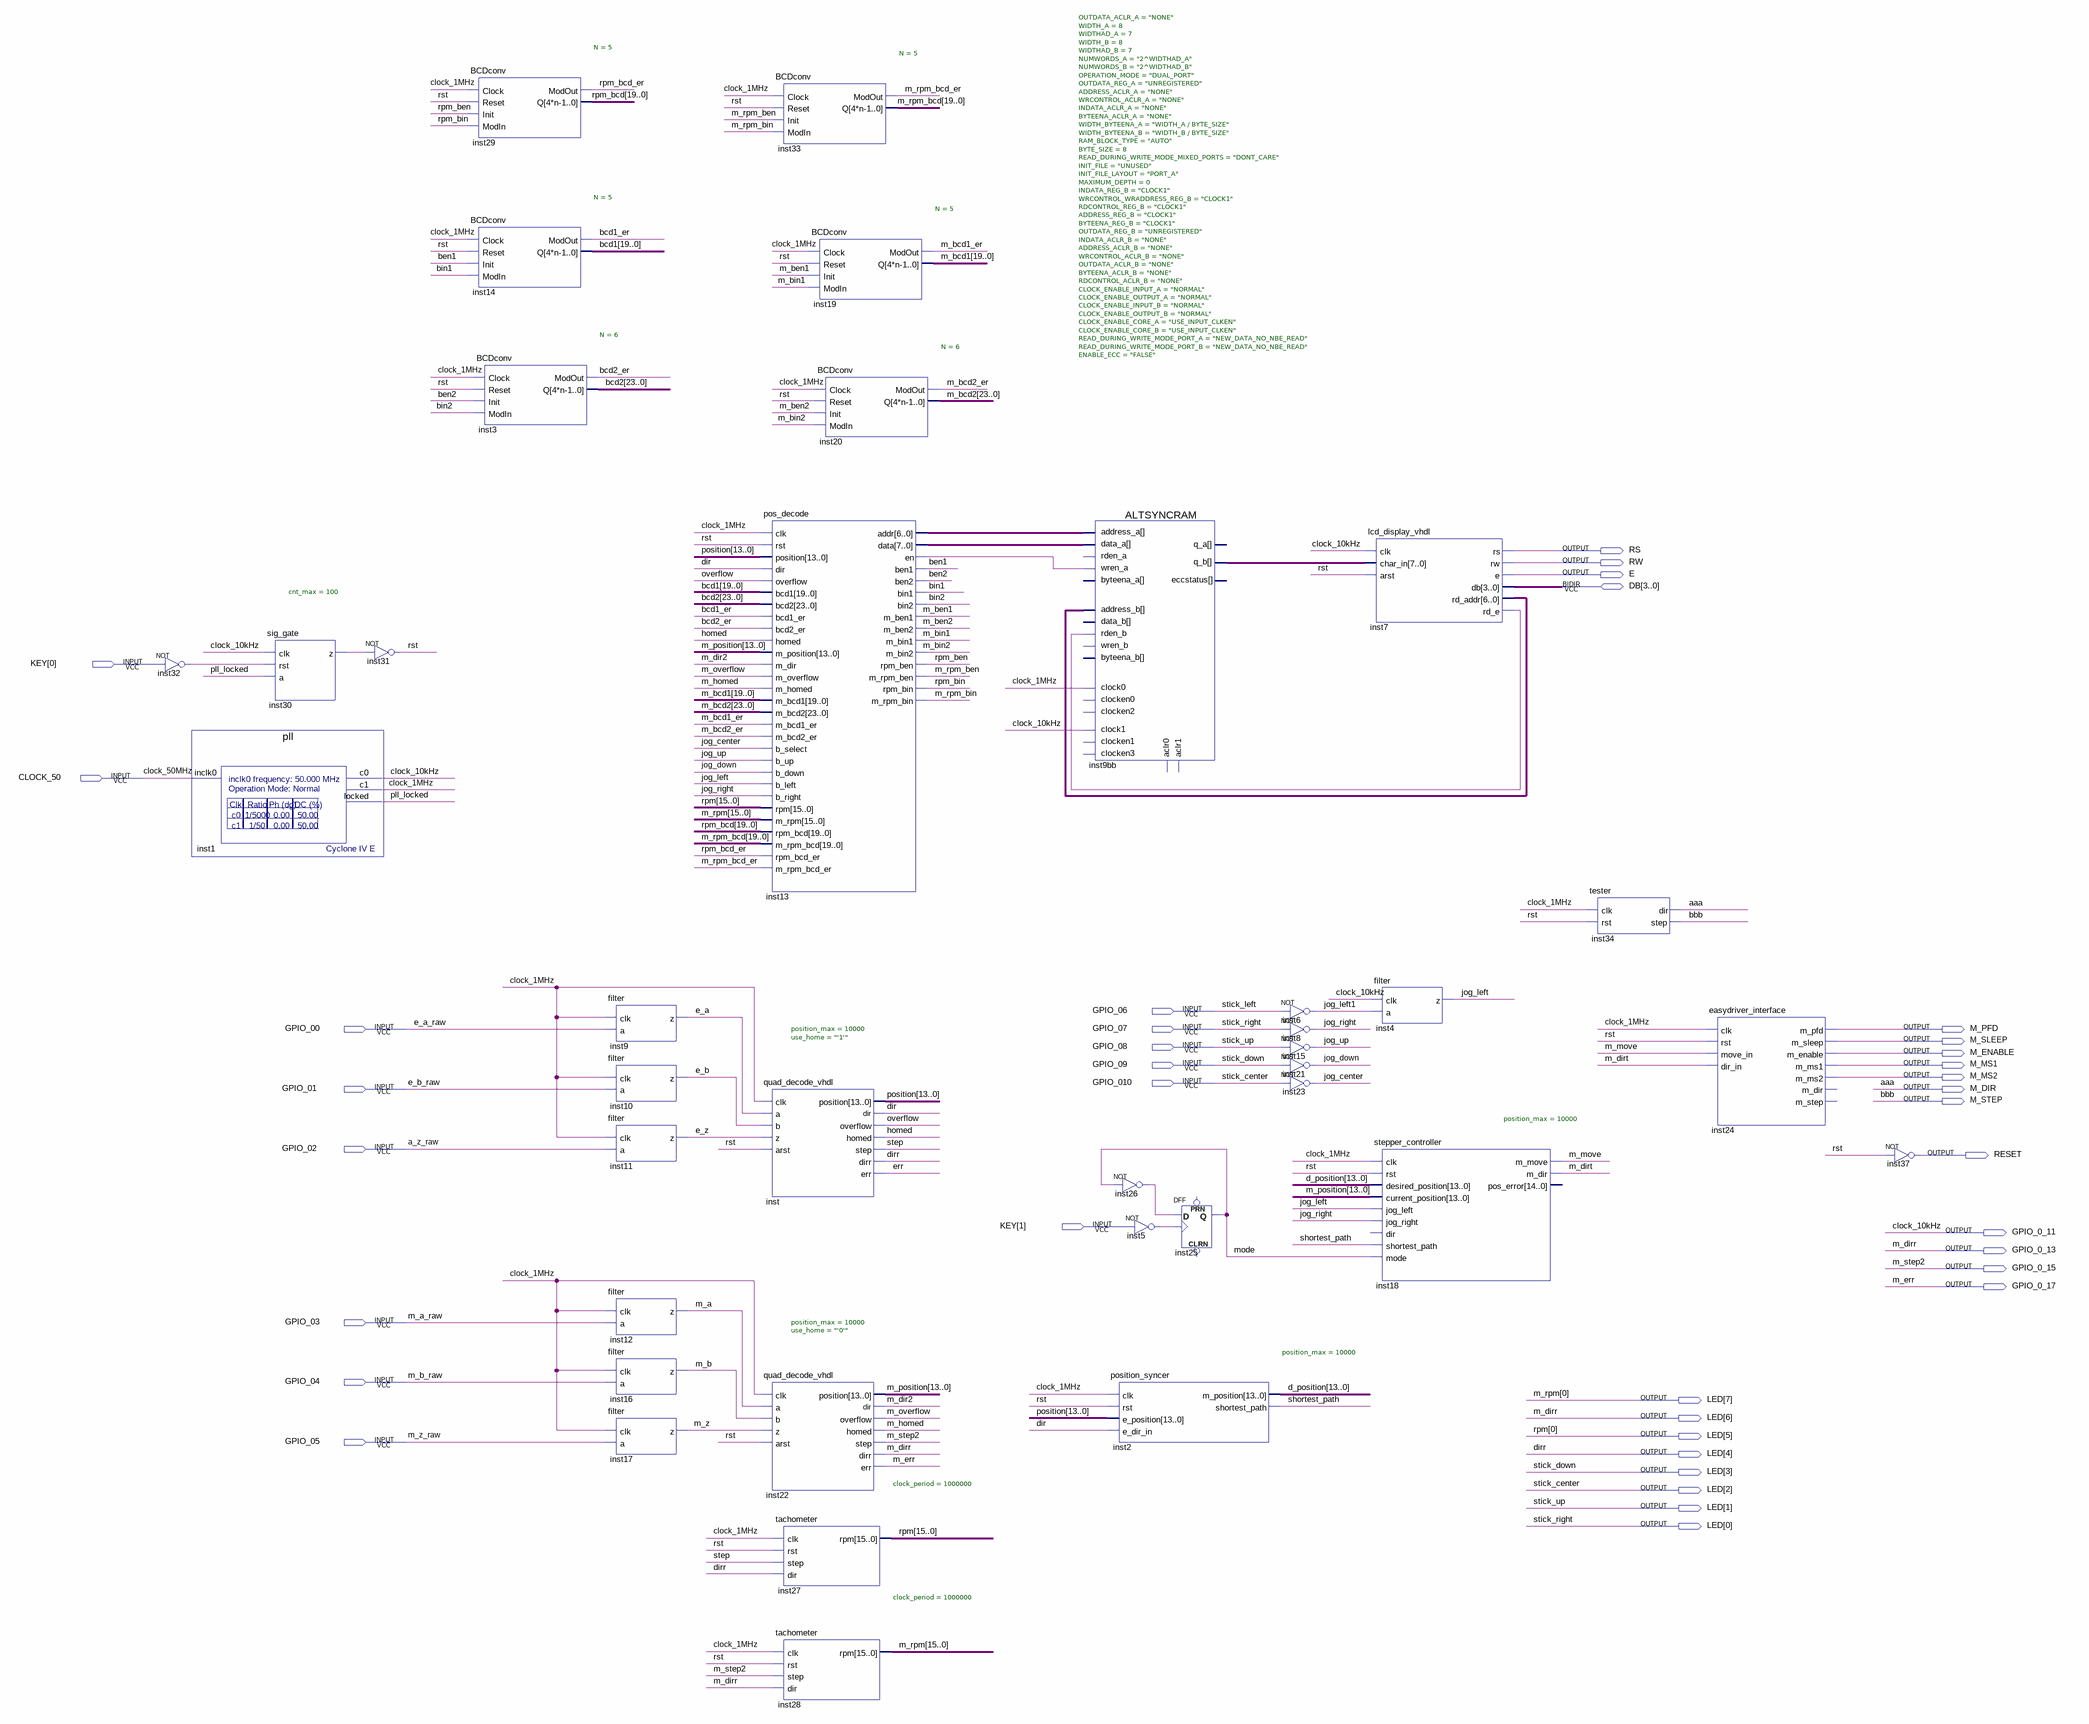
[diagram p0: schematic sheet]
// Quartus schematic rot_enc_fpga.bdf as structural Verilog: 37 symbols, 38 pins
module rot_enc_fpga (
  input  [1:0] KEY,
  input  CLOCK_50,
  input  GPIO_06,
  input  GPIO_00,
  input  GPIO_07,
  input  GPIO_08,
  input  GPIO_09,
  input  GPIO_010,
  input  GPIO_01,
  input  GPIO_02,
  input  GPIO_03,
  input  GPIO_04,
  input  GPIO_05,
  inout  [3:0] DB,
  output RS,
  output RW,
  output E,
  output M_PFD,
  output M_SLEEP,
  output M_ENABLE,
  output M_MS1,
  output M_MS2,
  output M_DIR,
  output M_STEP,
  output RESET,
  output GPIO_0_11,
  output GPIO_0_13,
  output GPIO_0_15,
  output GPIO_0_17,
  output [7:0] LED
);

  wire bcd1_er, bcd2_er, ben1, ben2, bin1, bin2, clock_1MHz, dir, e_a, e_b, e_z, err, homed, inst5_out,
       inst7_rd_e, inst13_en, inst26_out, inst30_z, inst32_out, jog_center, jog_down, jog_left, jog_left1,
       jog_right, jog_up, m_a, m_b, m_bcd1_er, m_bcd2_er, m_ben1, m_ben2, m_bin1, m_bin2, m_dir2, m_dirt,
       m_homed, m_move, m_overflow, m_rpm_bcd_er, m_rpm_ben, m_rpm_bin, m_z, mode, overflow, pll_locked,
       rpm_bcd_er, rpm_ben, rpm_bin, rst, shortest_path, step;
  wire [6:0] inst7_rd_addr, inst13_addr;
  wire [7:0] inst9bb_q_b, inst13_data;
  wire [13:0] d_position, m_position, position;
  wire [15:1] m_rpm, rpm;
  wire [19:0] bcd1, m_bcd1, m_rpm_bcd, rpm_bcd;
  wire [23:0] bcd2, m_bcd2;

  not inst32 (inst32_out, KEY[0]);
  pll inst1 (.inclk0(CLOCK_50), .c0(GPIO_0_11), .c1(clock_1MHz), .locked(pll_locked));
  sig_gate #(.cnt_max(100)) inst30 (.clk(GPIO_0_11), .rst(inst32_out), .a(pll_locked), .z(inst30_z));
  not inst31 (rst, inst30_z);
  BCDconv #(.N(5)) inst29 (
    .Clock(clock_1MHz), .Reset(rst), .Init(rpm_ben), .ModIn(rpm_bin), .ModOut(rpm_bcd_er), .Q(rpm_bcd));
  BCDconv #(.N(5)) inst14 (.Clock(clock_1MHz), .Reset(rst), .Init(ben1), .ModIn(bin1), .ModOut(bcd1_er), .Q(bcd1));
  BCDconv #(.N(6)) inst3 (.Clock(clock_1MHz), .Reset(rst), .Init(ben2), .ModIn(bin2), .ModOut(bcd2_er), .Q(bcd2));
  filter inst9 (.clk(clock_1MHz), .a(GPIO_00), .z(e_a));
  filter inst10 (.clk(clock_1MHz), .a(GPIO_01), .z(e_b));
  filter inst11 (.clk(clock_1MHz), .a(GPIO_02), .z(e_z));
  filter inst12 (.clk(clock_1MHz), .a(GPIO_03), .z(m_a));
  filter inst16 (.clk(clock_1MHz), .a(GPIO_04), .z(m_b));
  filter inst17 (.clk(clock_1MHz), .a(GPIO_05), .z(m_z));
  BCDconv #(.N(5)) inst33 (
    .Clock(clock_1MHz), .Reset(rst), .Init(m_rpm_ben), .ModIn(m_rpm_bin), .ModOut(m_rpm_bcd_er), .Q(m_rpm_bcd));
  pos_decode inst13 (
    .clk(clock_1MHz), .rst(rst), .position(position), .dir(dir), .overflow(overflow), .bcd1(bcd1),
    .bcd2(bcd2), .bcd1_er(bcd1_er), .bcd2_er(bcd2_er), .homed(homed), .m_position(m_position),
    .m_dir(m_dir2), .m_overflow(m_overflow), .m_homed(m_homed), .m_bcd1(m_bcd1), .m_bcd2(m_bcd2),
    .m_bcd1_er(m_bcd1_er), .m_bcd2_er(m_bcd2_er), .b_select(jog_center), .b_up(jog_up), .b_down(jog_down),
    .b_left(jog_left), .b_right(jog_right), .rpm({rpm, LED[5]}), .m_rpm({m_rpm, LED[7]}), .rpm_bcd(rpm_bcd),
    .m_rpm_bcd(m_rpm_bcd), .rpm_bcd_er(rpm_bcd_er), .m_rpm_bcd_er(m_rpm_bcd_er), .addr(inst13_addr),
    .data(inst13_data), .en(inst13_en), .ben1(ben1), .ben2(ben2), .bin1(bin1), .bin2(bin2), .m_ben1(m_ben1),
    .m_ben2(m_ben2), .m_bin1(m_bin1), .m_bin2(m_bin2), .rpm_ben(rpm_ben), .m_rpm_ben(m_rpm_ben),
    .rpm_bin(rpm_bin), .m_rpm_bin(m_rpm_bin));
  quad_decode_vhdl #(.position_max(10000), .use_home("'1'")) inst (
    .clk(clock_1MHz), .a(e_a), .b(e_b), .z(e_z), .arst(rst), .position(position), .dir(dir),
    .overflow(overflow), .homed(homed), .step(step), .dirr(LED[4]), .err(err));
  quad_decode_vhdl #(.position_max(10000), .use_home("'0'")) inst22 (
    .clk(clock_1MHz), .a(m_a), .b(m_b), .z(m_z), .arst(rst), .position(m_position), .dir(m_dir2),
    .overflow(m_overflow), .homed(m_homed), .step(GPIO_0_15), .dirr(GPIO_0_13), .err(GPIO_0_17));
  tachometer #(.clock_period(1000000)) inst27 (
    .clk(clock_1MHz), .rst(rst), .step(step), .dir(LED[4]), .rpm({rpm, LED[5]}));
  tachometer #(.clock_period(1000000)) inst28 (
    .clk(clock_1MHz), .rst(rst), .step(GPIO_0_15), .dir(GPIO_0_13), .rpm({m_rpm, LED[7]}));
  BCDconv #(.N(5)) inst19 (
    .Clock(clock_1MHz), .Reset(rst), .Init(m_ben1), .ModIn(m_bin1), .ModOut(m_bcd1_er), .Q(m_bcd1));
  BCDconv #(.N(6)) inst20 (
    .Clock(clock_1MHz), .Reset(rst), .Init(m_ben2), .ModIn(m_bin2), .ModOut(m_bcd2_er), .Q(m_bcd2));
  ALTSYNCRAM #(.OUTDATA_ACLR_A("NONE"), .WIDTH_A(8), .WIDTHAD_A(7), .WIDTH_B(8), .WIDTHAD_B(7), .NUMWORDS_A("2^WIDTHAD_A"), .NUMWORDS_B("2^WIDTHAD_B"), .OPERATION_MODE("DUAL_PORT"), .OUTDATA_REG_A("UNREGISTERED"), .ADDRESS_ACLR_A("NONE"), .WRCONTROL_ACLR_A("NONE"), .INDATA_ACLR_A("NONE"), .BYTEENA_ACLR_A("NONE"), .WIDTH_BYTEENA_A("WIDTH_A / BYTE_SIZE"), .WIDTH_BYTEENA_B("WIDTH_B / BYTE_SIZE"), .RAM_BLOCK_TYPE("AUTO"), .BYTE_SIZE(8), .READ_DURING_WRITE_MODE_MIXED_PORTS("DONT_CARE"), .INIT_FILE("UNUSED"), .INIT_FILE_LAYOUT("PORT_A"), .MAXIMUM_DEPTH(0), .INDATA_REG_B("CLOCK1"), .WRCONTROL_WRADDRESS_REG_B("CLOCK1"), .RDCONTROL_REG_B("CLOCK1"), .ADDRESS_REG_B("CLOCK1"), .BYTEENA_REG_B("CLOCK1"), .OUTDATA_REG_B("UNREGISTERED"), .INDATA_ACLR_B("NONE"), .ADDRESS_ACLR_B("NONE"), .WRCONTROL_ACLR_B("NONE"), .OUTDATA_ACLR_B("NONE"), .BYTEENA_ACLR_B("NONE"), .RDCONTROL_ACLR_B("NONE"), .CLOCK_ENABLE_INPUT_A("NORMAL"), .CLOCK_ENABLE_OUTPUT_A("NORMAL"), .CLOCK_ENABLE_INPUT_B("NORMAL"), .CLOCK_ENABLE_OUTPUT_B("NORMAL"), .CLOCK_ENABLE_CORE_A("USE_INPUT_CLKEN"), .CLOCK_ENABLE_CORE_B("USE_INPUT_CLKEN"), .READ_DURING_WRITE_MODE_PORT_A("NEW_DATA_NO_NBE_READ"), .READ_DURING_WRITE_MODE_PORT_B("NEW_DATA_NO_NBE_READ"), .ENABLE_ECC("FALSE")) inst9bb (
    .address_a(inst13_addr), .wren_a(inst13_en), .rden_b(inst7_rd_e), .clock0(clock_1MHz),
    .clock1(GPIO_0_11), .data_a(inst13_data), .address_b(inst7_rd_addr), .q_b(inst9bb_q_b));  // open: byteena_a, data_b, wren_b, byteena_b, clocken0, clocken1, aclr0, aclr1, clocken3, clocken2, rden_a, q_a, eccstatus
  not inst26 (inst26_out, mode);
  not inst5 (inst5_out, KEY[1]);
  position_syncer #(.position_max(10000)) inst2 (
    .clk(clock_1MHz), .rst(rst), .e_position(position), .e_dir_in(dir), .m_position(d_position),
    .shortest_path(shortest_path));
  DFF inst25 (.CLK(inst5_out), .D(inst26_out), .Q(mode));  // open: CLRN, PRN
  not inst6 (jog_left1, GPIO_06);
  not inst8 (jog_right, GPIO_07);
  not inst15 (jog_up, GPIO_08);
  not inst21 (jog_down, GPIO_09);
  not inst23 (jog_center, GPIO_010);
  lcd_display_vhdl inst7 (
    .clk(GPIO_0_11), .char_in(inst9bb_q_b), .arst(rst), .rs(RS), .rw(RW), .e(E), .db(DB),
    .rd_addr(inst7_rd_addr), .rd_e(inst7_rd_e));
  filter inst4 (.clk(GPIO_0_11), .a(jog_left1), .z(jog_left));
  stepper_controller #(.position_max(10000)) inst18 (
    .clk(clock_1MHz), .rst(rst), .desired_position(d_position), .current_position(m_position),
    .jog_left(jog_left), .jog_right(jog_right), .shortest_path(shortest_path), .mode(mode), .m_move(m_move),
    .m_dir(m_dirt));  // open: dir, pos_error
  tester inst34 (.clk(clock_1MHz), .rst(rst), .dir(M_DIR), .step(M_STEP));
  easydriver_interface inst24 (
    .clk(clock_1MHz), .rst(rst), .move_in(m_move), .dir_in(m_dirt), .m_pfd(M_PFD), .m_sleep(M_SLEEP),
    .m_enable(M_ENABLE), .m_ms1(M_MS1), .m_ms2(M_MS2));  // open: m_dir, m_step
  not inst37 (RESET, rst);

  assign {LED[6], LED[3:0]} = {GPIO_0_13, GPIO_09, GPIO_010, GPIO_08, GPIO_07};

  // Other names for the same wires on the sheet: a_z_raw = GPIO_02; aaa = M_DIR; bbb = M_STEP;
  //   clock_10kHz = GPIO_0_11; clock_50MHz = CLOCK_50; dirr = LED[4]; e_a_raw = GPIO_00; e_b_raw = GPIO_01;
  //   m_a_raw = GPIO_03; m_b_raw = GPIO_04; m_dirr = GPIO_0_13; m_err = GPIO_0_17; m_rpm[0] = LED[7];
  //   m_step2 = GPIO_0_15; m_z_raw = GPIO_05; rpm[0] = LED[5]; stick_center = GPIO_010; stick_down = GPIO_09;
  //   stick_left = GPIO_06; stick_right = GPIO_07; stick_up = GPIO_08
endmodule
